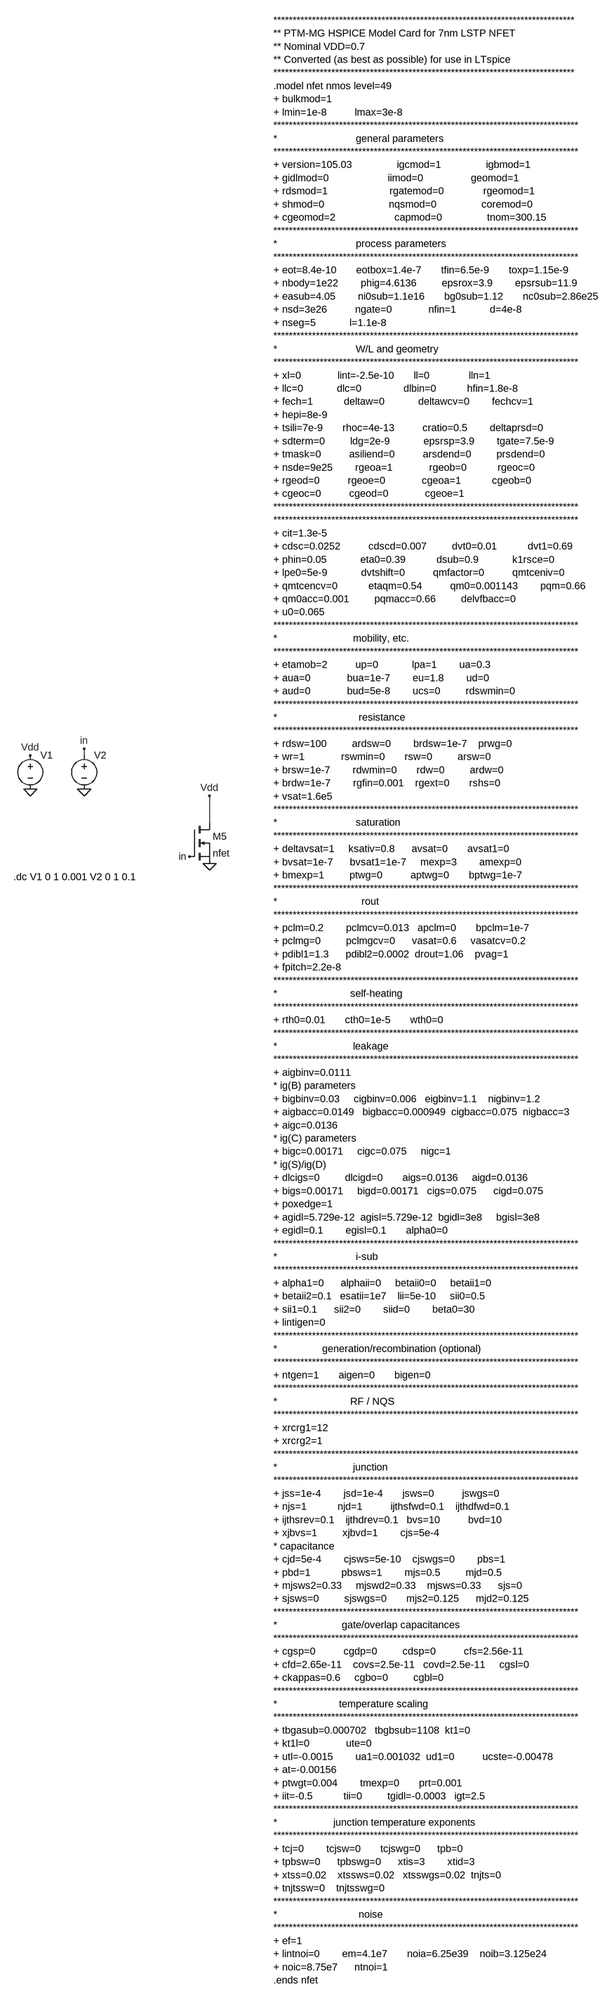
[diagram p0: schematic transistor_7n.asc]
transistor_7n.asc, the LTspice schematic file:
Version 4
SHEET 1 6288 2520
WIRE -128 -48 -128 -64
WIRE 688 112 688 48
FLAG -256 32 0
FLAG -256 -48 Vdd
FLAG 688 48 Vdd
FLAG -128 32 0
FLAG -128 -64 in
FLAG 640 192 in
FLAG 688 208 0
SYMBOL voltage -256 -64 R0
WINDOW 123 0 0 Left 0
WINDOW 39 0 0 Left 0
SYMATTR InstName V1
SYMATTR Value ""
SYMBOL voltage -128 -64 R0
WINDOW 123 0 0 Left 0
WINDOW 39 0 0 Left 0
SYMATTR InstName V2
SYMATTR Value ""
SYMBOL nmos 640 112 R0
SYMATTR InstName M5
SYMATTR Value nfet
TEXT 5128 -1792 Left 2 !******************************************************************************\n** PTM-MG HSPICE Model Card for 7nm LSTP NFET \n** Nominal VDD=0.7\n** Converted (as best as possible) for use in LTspice\n******************************************************************************\n.model nfet nmos level=49\n+ bulkmod=1\n+ lmin=1e-8          lmax=3e-8\n*******************************************************************************\n*                            general parameters\n*******************************************************************************\n+ version=105.03                igcmod=1                igbmod=1\n+ gidlmod=0                     iimod=0                 geomod=1\n+ rdsmod=1                      rgatemod=0              rgeomod=1\n+ shmod=0                       nqsmod=0                coremod=0\n+ cgeomod=2                     capmod=0                tnom=300.15\n*******************************************************************************\n*                            process parameters\n*******************************************************************************\n+ eot=8.4e-10       eotbox=1.4e-7       tfin=6.5e-9       toxp=1.15e-9\n+ nbody=1e22        phig=4.6136         epsrox=3.9        epsrsub=11.9\n+ easub=4.05        ni0sub=1.1e16       bg0sub=1.12       nc0sub=2.86e25\n+ nsd=3e26          ngate=0             nfin=1            d=4e-8\n+ nseg=5            l=1.1e-8\n*******************************************************************************\n*                            W/L and geometry\n*******************************************************************************\n+ xl=0             lint=-2.5e-10       ll=0              lln=1\n+ llc=0            dlc=0               dlbin=0           hfin=1.8e-8\n+ fech=1           deltaw=0            deltawcv=0        fechcv=1\n+ hepi=8e-9\n+ tsili=7e-9       rhoc=4e-13          cratio=0.5        deltaprsd=0\n+ sdterm=0         ldg=2e-9            epsrsp=3.9        tgate=7.5e-9\n+ tmask=0          asiliend=0          arsdend=0         prsdend=0\n+ nsde=9e25        rgeoa=1             rgeob=0           rgeoc=0\n+ rgeod=0          rgeoe=0             cgeoa=1           cgeob=0\n+ cgeoc=0          cgeod=0             cgeoe=1\n*******************************************************************************\n*******************************************************************************\n+ cit=1.3e-5\n+ cdsc=0.0252          cdscd=0.007         dvt0=0.01           dvt1=0.69\n+ phin=0.05            eta0=0.39           dsub=0.9            k1rsce=0\n+ lpe0=5e-9            dvtshift=0          qmfactor=0          qmtceniv=0\n+ qmtcencv=0           etaqm=0.54          qm0=0.001143        pqm=0.66\n+ qm0acc=0.001         pqmacc=0.66         delvfbacc=0\n+ u0=0.065\n*******************************************************************************\n*                           mobility, etc.\n*******************************************************************************\n+ etamob=2          up=0            lpa=1        ua=0.3\n+ aua=0             bua=1e-7        eu=1.8        ud=0\n+ aud=0             bud=5e-8        ucs=0         rdswmin=0\n*******************************************************************************\n*                             resistance\n*******************************************************************************\n+ rdsw=100         ardsw=0        brdsw=1e-7    prwg=0\n+ wr=1             rswmin=0       rsw=0         arsw=0\n+ brsw=1e-7        rdwmin=0       rdw=0         ardw=0\n+ brdw=1e-7        rgfin=0.001    rgext=0       rshs=0\n+ vsat=1.6e5\n*******************************************************************************\n*                            saturation\n*******************************************************************************\n+ deltavsat=1     ksativ=0.8      avsat=0       avsat1=0\n+ bvsat=1e-7      bvsat1=1e-7     mexp=3        amexp=0\n+ bmexp=1         ptwg=0          aptwg=0       bptwg=1e-7\n*******************************************************************************\n*                              rout\n*******************************************************************************\n+ pclm=0.2        pclmcv=0.013   apclm=0       bpclm=1e-7\n+ pclmg=0         pclmgcv=0      vasat=0.6     vasatcv=0.2\n+ pdibl1=1.3      pdibl2=0.0002  drout=1.06    pvag=1\n+ fpitch=2.2e-8\n*******************************************************************************\n*                          self-heating\n*******************************************************************************\n+ rth0=0.01       cth0=1e-5       wth0=0\n*******************************************************************************\n*                           leakage\n*******************************************************************************\n+ aigbinv=0.0111\n* ig(B) parameters\n+ bigbinv=0.03     cigbinv=0.006   eigbinv=1.1    nigbinv=1.2\n+ aigbacc=0.0149   bigbacc=0.000949  cigbacc=0.075  nigbacc=3\n+ aigc=0.0136\n* ig(C) parameters\n+ bigc=0.00171     cigc=0.075     nigc=1\n* ig(S)/ig(D)\n+ dlcigs=0         dlcigd=0       aigs=0.0136     aigd=0.0136\n+ bigs=0.00171     bigd=0.00171   cigs=0.075      cigd=0.075\n+ poxedge=1\n+ agidl=5.729e-12  agisl=5.729e-12  bgidl=3e8     bgisl=3e8\n+ egidl=0.1        egisl=0.1       alpha0=0\n*******************************************************************************\n*                            i-sub\n*******************************************************************************\n+ alpha1=0      alphaii=0     betaii0=0     betaii1=0\n+ betaii2=0.1   esatii=1e7    lii=5e-10     sii0=0.5\n+ sii1=0.1      sii2=0        siid=0        beta0=30\n+ lintigen=0\n*******************************************************************************\n*                generation/recombination (optional)\n*******************************************************************************\n+ ntgen=1       aigen=0       bigen=0\n*******************************************************************************\n*                          RF / NQS\n*******************************************************************************\n+ xrcrg1=12\n+ xrcrg2=1\n*******************************************************************************\n*                           junction\n*******************************************************************************\n+ jss=1e-4        jsd=1e-4       jsws=0          jswgs=0\n+ njs=1           njd=1          ijthsfwd=0.1    ijthdfwd=0.1\n+ ijthsrev=0.1    ijthdrev=0.1   bvs=10          bvd=10\n+ xjbvs=1         xjbvd=1        cjs=5e-4\n* capacitance\n+ cjd=5e-4        cjsws=5e-10    cjswgs=0        pbs=1\n+ pbd=1           pbsws=1        mjs=0.5         mjd=0.5\n+ mjsws2=0.33     mjswd2=0.33    mjsws=0.33      sjs=0\n+ sjsws=0         sjswgs=0       mjs2=0.125      mjd2=0.125\n*******************************************************************************\n*                       gate/overlap capacitances\n*******************************************************************************\n+ cgsp=0          cgdp=0         cdsp=0          cfs=2.56e-11\n+ cfd=2.65e-11    covs=2.5e-11   covd=2.5e-11     cgsl=0\n+ ckappas=0.6     cgbo=0         cgbl=0\n*******************************************************************************\n*                      temperature scaling\n*******************************************************************************\n+ tbgasub=0.000702   tbgbsub=1108  kt1=0\n+ kt1l=0             ute=0\n+ utl=-0.0015        ua1=0.001032  ud1=0          ucste=-0.00478\n+ at=-0.00156\n+ ptwgt=0.004        tmexp=0       prt=0.001\n+ iit=-0.5           tii=0         tgidl=-0.0003   igt=2.5\n*******************************************************************************\n*                    junction temperature exponents\n*******************************************************************************\n+ tcj=0        tcjsw=0       tcjswg=0      tpb=0\n+ tpbsw=0      tpbswg=0      xtis=3        xtid=3\n+ xtss=0.02    xtssws=0.02   xtsswgs=0.02  tnjts=0\n+ tnjtssw=0    tnjtsswg=0\n*******************************************************************************\n*                             noise\n*******************************************************************************\n+ ef=1\n+ lintnoi=0        em=4.1e7       noia=6.25e39    noib=3.125e24\n+ noic=8.75e7      ntnoi=1\n.ends nfet
TEXT -296 240 Left 2 !.dc V1 0 1 0.001 V2 0 1 0.1

The netlist it stands for:
* transistor_7n.asc
V1 Vdd 0
V2 in 0
M5 Vdd in 0 0 nfet
.model NMOS NMOS
.model PMOS PMOS
.lib standard.mos
******************************************************************************
** PTM-MG HSPICE Model Card for 7nm LSTP NFET
** Nominal VDD=0.7
** Converted (as best as possible) for use in LTspice
******************************************************************************
.model nfet nmos level=49
+ bulkmod=1
+ lmin=1e-8          lmax=3e-8
*******************************************************************************
*                            general parameters
*******************************************************************************
+ version=105.03                igcmod=1                igbmod=1
+ gidlmod=0                     iimod=0                 geomod=1
+ rdsmod=1                      rgatemod=0              rgeomod=1
+ shmod=0                       nqsmod=0                coremod=0
+ cgeomod=2                     capmod=0                tnom=300.15
*******************************************************************************
*                            process parameters
*******************************************************************************
+ eot=8.4e-10       eotbox=1.4e-7       tfin=6.5e-9       toxp=1.15e-9
+ nbody=1e22        phig=4.6136         epsrox=3.9        epsrsub=11.9
+ easub=4.05        ni0sub=1.1e16       bg0sub=1.12       nc0sub=2.86e25
+ nsd=3e26          ngate=0             nfin=1            d=4e-8
+ nseg=5            l=1.1e-8
*******************************************************************************
*                            W/L and geometry
*******************************************************************************
+ xl=0             lint=-2.5e-10       ll=0              lln=1
+ llc=0            dlc=0               dlbin=0           hfin=1.8e-8
+ fech=1           deltaw=0            deltawcv=0        fechcv=1
+ hepi=8e-9
+ tsili=7e-9       rhoc=4e-13          cratio=0.5        deltaprsd=0
+ sdterm=0         ldg=2e-9            epsrsp=3.9        tgate=7.5e-9
+ tmask=0          asiliend=0          arsdend=0         prsdend=0
+ nsde=9e25        rgeoa=1             rgeob=0           rgeoc=0
+ rgeod=0          rgeoe=0             cgeoa=1           cgeob=0
+ cgeoc=0          cgeod=0             cgeoe=1
*******************************************************************************
*******************************************************************************
+ cit=1.3e-5
+ cdsc=0.0252          cdscd=0.007         dvt0=0.01           dvt1=0.69
+ phin=0.05            eta0=0.39           dsub=0.9            k1rsce=0
+ lpe0=5e-9            dvtshift=0          qmfactor=0          qmtceniv=0
+ qmtcencv=0           etaqm=0.54          qm0=0.001143        pqm=0.66
+ qm0acc=0.001         pqmacc=0.66         delvfbacc=0
+ u0=0.065
*******************************************************************************
*                           mobility, etc.
*******************************************************************************
+ etamob=2          up=0            lpa=1        ua=0.3
+ aua=0             bua=1e-7        eu=1.8        ud=0
+ aud=0             bud=5e-8        ucs=0         rdswmin=0
*******************************************************************************
*                             resistance
*******************************************************************************
+ rdsw=100         ardsw=0        brdsw=1e-7    prwg=0
+ wr=1             rswmin=0       rsw=0         arsw=0
+ brsw=1e-7        rdwmin=0       rdw=0         ardw=0
+ brdw=1e-7        rgfin=0.001    rgext=0       rshs=0
+ vsat=1.6e5
*******************************************************************************
*                            saturation
*******************************************************************************
+ deltavsat=1     ksativ=0.8      avsat=0       avsat1=0
+ bvsat=1e-7      bvsat1=1e-7     mexp=3        amexp=0
+ bmexp=1         ptwg=0          aptwg=0       bptwg=1e-7
*******************************************************************************
*                              rout
*******************************************************************************
+ pclm=0.2        pclmcv=0.013   apclm=0       bpclm=1e-7
+ pclmg=0         pclmgcv=0      vasat=0.6     vasatcv=0.2
+ pdibl1=1.3      pdibl2=0.0002  drout=1.06    pvag=1
+ fpitch=2.2e-8
*******************************************************************************
*                          self-heating
*******************************************************************************
+ rth0=0.01       cth0=1e-5       wth0=0
*******************************************************************************
*                           leakage
*******************************************************************************
+ aigbinv=0.0111
* ig(B) parameters
+ bigbinv=0.03     cigbinv=0.006   eigbinv=1.1    nigbinv=1.2
+ aigbacc=0.0149   bigbacc=0.000949  cigbacc=0.075  nigbacc=3
+ aigc=0.0136
* ig(C) parameters
+ bigc=0.00171     cigc=0.075     nigc=1
* ig(S)/ig(D)
+ dlcigs=0         dlcigd=0       aigs=0.0136     aigd=0.0136
+ bigs=0.00171     bigd=0.00171   cigs=0.075      cigd=0.075
+ poxedge=1
+ agidl=5.729e-12  agisl=5.729e-12  bgidl=3e8     bgisl=3e8
+ egidl=0.1        egisl=0.1       alpha0=0
*******************************************************************************
*                            i-sub
*******************************************************************************
+ alpha1=0      alphaii=0     betaii0=0     betaii1=0
+ betaii2=0.1   esatii=1e7    lii=5e-10     sii0=0.5
+ sii1=0.1      sii2=0        siid=0        beta0=30
+ lintigen=0
*******************************************************************************
*                generation/recombination (optional)
*******************************************************************************
+ ntgen=1       aigen=0       bigen=0
*******************************************************************************
*                          RF / NQS
*******************************************************************************
+ xrcrg1=12
+ xrcrg2=1
*******************************************************************************
*                           junction
*******************************************************************************
+ jss=1e-4        jsd=1e-4       jsws=0          jswgs=0
+ njs=1           njd=1          ijthsfwd=0.1    ijthdfwd=0.1
+ ijthsrev=0.1    ijthdrev=0.1   bvs=10          bvd=10
+ xjbvs=1         xjbvd=1        cjs=5e-4
* capacitance
+ cjd=5e-4        cjsws=5e-10    cjswgs=0        pbs=1
+ pbd=1           pbsws=1        mjs=0.5         mjd=0.5
+ mjsws2=0.33     mjswd2=0.33    mjsws=0.33      sjs=0
+ sjsws=0         sjswgs=0       mjs2=0.125      mjd2=0.125
*******************************************************************************
*                       gate/overlap capacitances
*******************************************************************************
+ cgsp=0          cgdp=0         cdsp=0          cfs=2.56e-11
+ cfd=2.65e-11    covs=2.5e-11   covd=2.5e-11     cgsl=0
+ ckappas=0.6     cgbo=0         cgbl=0
*******************************************************************************
*                      temperature scaling
*******************************************************************************
+ tbgasub=0.000702   tbgbsub=1108  kt1=0
+ kt1l=0             ute=0
+ utl=-0.0015        ua1=0.001032  ud1=0          ucste=-0.00478
+ at=-0.00156
+ ptwgt=0.004        tmexp=0       prt=0.001
+ iit=-0.5           tii=0         tgidl=-0.0003   igt=2.5
*******************************************************************************
*                    junction temperature exponents
*******************************************************************************
+ tcj=0        tcjsw=0       tcjswg=0      tpb=0
+ tpbsw=0      tpbswg=0      xtis=3        xtid=3
+ xtss=0.02    xtssws=0.02   xtsswgs=0.02  tnjts=0
+ tnjtssw=0    tnjtsswg=0
*******************************************************************************
*                             noise
*******************************************************************************
+ ef=1
+ lintnoi=0        em=4.1e7       noia=6.25e39    noib=3.125e24
+ noic=8.75e7      ntnoi=1
.ends nfet
.dc V1 0 1 0.001 V2 0 1 0.1
.backanno
.end